# EAGLE design ReSpeaker_Mic_SMD20_V04 (EAGLE 9.2.2)
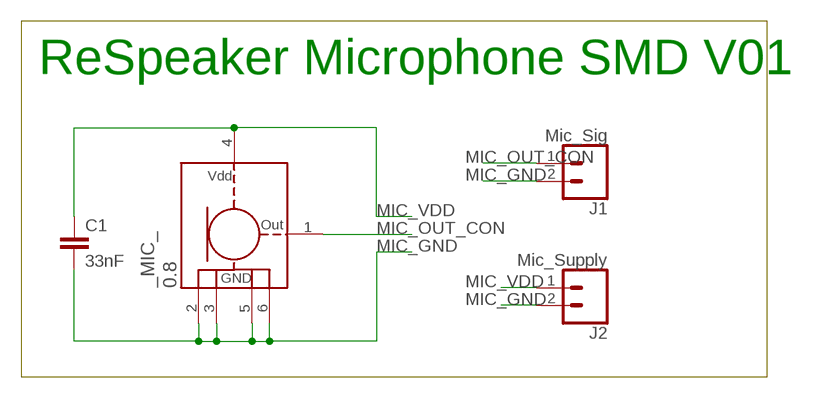
[diagram p0: schematic, sheet 1]

## Parts
_MIC_  0.8  SPU0410LR5H-QBSPU0410LR5H-QB_0.8  [SPU0410LR5H-QB_0.8]
C1  33nF  1.0UF-0805-25V-10%  [0805]
J1  Mic_Sig  CONN_021X02_2MM  [1X02_2.0MM]
J2  Mic_Supply  CONN_021X02_2MM  [1X02_2.0MM]

## Nets
MIC_GND: _MIC_.2(GND) _MIC_.3(GND) _MIC_.5(GND) _MIC_.6(GND) C1.2 J1.2 J2.2
MIC_OUT_CON: _MIC_.1(OUT) J1.1
MIC_VDD: _MIC_.4(VDD) C1.1 J2.1

## Notes on the sheet
- ReSpeaker Microphone SMD V01

## Library data of the parts
_MIC_ = Knowles_Microphone:SPU0410LR5H-QB
C1 = SparkFun-Capacitors:1.0UF: 1µF ceramic capacitors A capacitor is a passive two-terminal electrical component used to store electrical energy temporarily in an electric field.; PROD_ID: CAP-08064; VALUE: 1.0uF
J1 J2 = My-Connectors:CONN_02: Multi connection point. Often used as Generic Header-pin footprint for 0.1 inch spaced/style header connections On any of the 0.1 inch spaced packages, you can populate with these: Break Away Headers - Straight <https://www.sparkfun.com/products/116> (PRT-00116) Break Away Male Headers - Right Angle <https://www.sparkfun.com/products/553> (PRT-00553) Female Headers <https://www.sparkfun.com/products/115> (PRT-00115) Break Away Headers - Machine Pin <https://www.sparkfun.com/products/117> (PRT-00117) Break Away Female Headers - Swiss Machine Pin <https://www.sparkfun.com/products/743> (PRT-00743) For SCREWTERMINALS and SPRING TERMINALS visit here: Screw Terimnals on SparkFun.com <https://www.sparkfun.com/search/results?term=Screw+Terminals> (5mm/3.5mm/2.54mm spacing) This device is also useful as a general connection point to wire up your design to another part of your project. Our various solder wires solder well into these plated through hole pads. Hook-Up Wire - Assortment (Stranded, 22 AWG) <https://www.sparkfun.com/products/11375> (PRT-11375) Hook-Up Wire - Assortment (Solid Core, 22 AWG) <https://www.sparkfun.com/products/11367> (PRT-11367) View the entire wire category on our website here <https://www.sparkfun.com/categories/141> Special notes: Molex polarized connector foot print use with: PRT-08233 with associated crimp pins and housings. 2.54_SCREWTERM for use with PRT-10571. 3.5mm Screw Terminal footprints for PRT-08084 5mm Screw Terminal footprints for use with PRT-08432

## Net classes
0 default: width 0.254 mm, drill 0.4 mm, clearance 0.203 mm

## Board
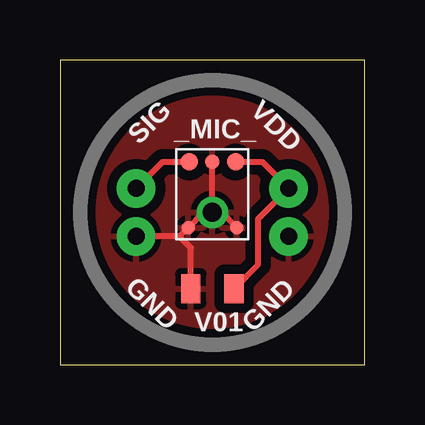
[diagram p1: board, top side]
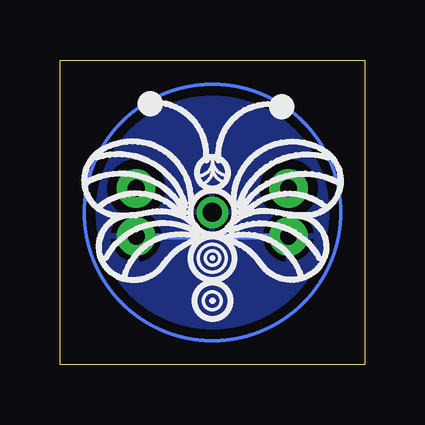
[diagram p2: board, bottom side, seen from below]

Size 12.7 x 12.7 mm. Coordinates in mm from the lower left corner, seen from the top.
Outline: 0,12.7 0,0 12.7,0 12.7,12.7 0,12.7
Copper layers (1*16): Top 0.035mm / dielectric 1.5mm / Bottom 0.035mm
Design rules "Modified-SparkFun-2-layer-STANDARD": minimum track width 10mil, minimum drill 10mil, track to track 10mil, track to pad 8mil, pad to pad 8mil, via to via 10mil, smd to smd 8mil, copper to edge 8mil, drill to drill 8mil, minimum pad ring 10mil, minimum via ring 10mil, stop-mask expansion 4mil, vias tented up to drill 25mil, thermal gap 10mil

### Footprints (pad centres in the part's own frame; a part is rotated, then mirrored left to right if it is on the bottom)
SPU0410LR5H-QB_0.8 = smd 0.723 x 0.723: 1 -0.966,2.103; 4 0.966,2.103 | smd 0.562 x 0.562: 2 -1.015,-0.634; 3 1.015,-0.634 | smd 0.612 x 0.612: 5 0,2.103 | drill 0.8 pad 1.2: 6 0,0
0805 = smd 0.8 x 1.2: 1 -0.9,0; 2 0.9,0
1X02_2.0MM = drill 0.7 pad 1.6: 1 -1,0; 2 1,0

### Placement (x,y rotation side)
_MIC_  6.35,6.35 0 top
C1  6.35,3.17 180 top
J1  3.17,6.35 270 top
J2  9.53,6.35 270 top

### Tracks (layer width: path | path; a pad name or v marks a point on that pad's centre or on a via)
MIC_GND
  Top 0.254: 4.97,5.35 _MIC_.2 5.97,6.35 _MIC_.6 | 4.97,5.35 J1.2 | C1.2 5.45,4.87 4.97,5.35 | _MIC_.3 6.73,6.35 _MIC_.6 | _MIC_.6 _MIC_.5
  Bottom 0.254: J2.2 J1.2
  pour Top (isolate 0.406): 0.64,0.64 12.06,0.64 12.06,12.06 0.64,12.06
  pour Bottom (isolate 0.406): 0.64,0.64 12.06,0.64 12.06,12.06 0.64,12.06
MIC_OUT_CON
  Top 0.254: J1.1 4.28,8.45 _MIC_.1
MIC_VDD
  Top 0.254: _MIC_.4 8.42,8.45 J2.1 8.26,6.08 8.26,4.18 C1.1
(copper drawn outside any net)
  shapes: Bottom circle x1, Top circle x1

### Text on the board
tPlace: VDD | SIG | GND | GND | V01